# EAGLE design CC2-32K-EPROM-CARTRIDGE-2012-V1RA (EAGLE 5.10)
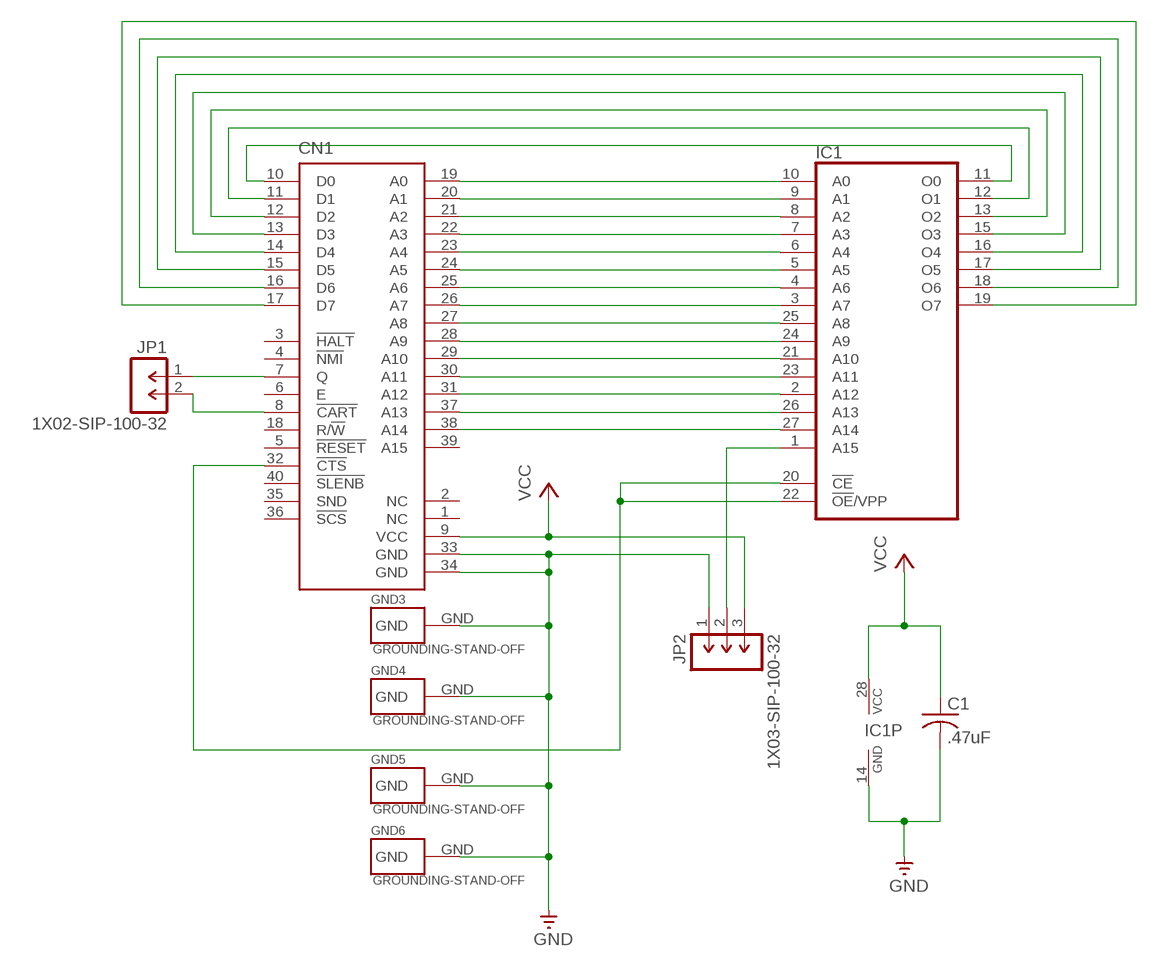
[diagram p0: schematic, sheet 1]

## Parts
C1  .47uF  NP-CAPACITOR-C050-025X075  [C050-025X075]
CN1  COCO3-CARTRIDGE-PLUG-SHORT  [EDGE-CARD-PLUG-2X20-100-SHORT]
GND3  GROUNDING-STAND-OFF  [STAND-OFF]
GND4  GROUNDING-STAND-OFF  [STAND-OFF]
GND5  GROUNDING-STAND-OFF  [STAND-OFF]
GND6  GROUNDING-STAND-OFF  [STAND-OFF]
IC1  27C512D-MINIMAL-OUTLINE  [DIL28-6-MINIMAL-OUTLINE]
JP1  1X02-SIP-100-32  [SIL1X02-100]
JP2  1X03-SIP-100-32  [SIL1X03-100]

## Nets
GND [power]: C1.2(-) CN1.33(GND) CN1.34(GND) GND3.GND GND4.GND GND5.GND GND6.GND IC1.14(GND) JP2.1
N$1: CN1.7(Q) JP1.1
N$2: CN1.8(!CART) JP1.2
N$4: CN1.32(!CTS) IC1.20(!CE) IC1.22(!OE!/VPP)
N$5: IC1.1(A15) JP2.2
N$6: CN1.10(D0) IC1.11(O0)
N$7: CN1.11(D1) IC1.12(O1)
N$8: CN1.19(A0) IC1.10(A0)
N$9: CN1.38(A14) IC1.27(A14)
N$10: CN1.37(A13) IC1.26(A13)
N$11: CN1.31(A12) IC1.2(A12)
N$12: CN1.30(A11) IC1.23(A11)
N$13: CN1.29(A10) IC1.21(A10)
N$14: CN1.28(A9) IC1.24(A9)
N$15: CN1.27(A8) IC1.25(A8)
N$16: CN1.26(A7) IC1.3(A7)
N$17: CN1.25(A6) IC1.4(A6)
N$18: CN1.24(A5) IC1.5(A5)
N$19: CN1.23(A4) IC1.6(A4)
N$20: CN1.22(A3) IC1.7(A3)
N$21: CN1.21(A2) IC1.8(A2)
N$22: CN1.20(A1) IC1.9(A1)
N$23: CN1.12(D2) IC1.13(O2)
N$24: CN1.13(D3) IC1.15(O3)
N$25: CN1.14(D4) IC1.16(O4)
N$26: CN1.15(D5) IC1.17(O5)
N$27: CN1.16(D6) IC1.18(O6)
N$28: CN1.17(D7) IC1.19(O7)
VCC [power]: C1.1(+) CN1.9(VCC) IC1.28(VCC) JP2.3
Unconnected: CN1.1(NC) CN1.2(NC) CN1.3(!HALT) CN1.4(!NMI) CN1.5(!RESET) CN1.6(E) CN1.18(R/!W) CN1.35(SND) CN1.36(!SCS) CN1.39(A15) CN1.40(!SLENB)

## Library data of the parts
C1 = GIMEchip-Capacitor:NP-CAPACITOR: NON-POLARIZED CAPACITOR grid 5mm
CN1 = GIMEchip-TRS-80-CoCo-3-Program-Pak-Cartridge:COCO3-CARTRIDGE-PLUG: CoCo 3 Program Pak Cartridge Plug - http://www.GIMEchip.com/ Tandy Radio Shack TRS-80 Color Computer 3 Program Pak Cartridge Plug (Edge-Card) E.A.G.L.E. Library Part created by John Eric Turner & His Father - sales@gimechip.com <mailto:sales@gimechip.com?subject=Tandy Radio Shack TRS- 80 Color Computer 3 Program Pak Cartridge Plug (Edge-Card) E.A.G.L.E. Library Part> 40-Pin Edge-Card sharing the same pinout as the Program Pak Cartridge Edge-Card Connector. This library part has been designed to provide a 40-pin cartridge plug connector matching the CoCo's Edge-Card connector (Cartridge Slot). This library part is also useful with the Dragon and other CoCo clones. It is important to note that the CoCo 2 & 3 only provide +5V at the cartridge connector. The CoCo 1 provides +5V AND +/-12V at the cartridge connector. The Dragon provides only +5V and +12V at the cartridge connector. The table below lists all similarities and differences between these machines, relevant to the cartridge slot: PIN # TRS-80 "CoCo 1" Function Tano/Dragon Data "Dragon 32/64" Function TRS-80 "CoCo 2 & 3" Function 1 -12V +12V NC 2 +12V +12V NC 3 HALT* HALT* HALT* 4 NMI* NMI* NMI* 5 RESET* RESET* RESET* 6 E E E 7 Q Q Q 8 CART* CART* CART* 9 +5V +5V +5V 10 D0 D0 D0 11 D1 D1 D1 12 D2 D2 D2 13 D3 D3 D3 14 D4 D4 D4 15 D5 D5 D5 16 D6 D6 D6 17 D7 D7 D7 18 R/W* R/W* R/W* 19 A0 A0 A0 20 A1 A1 A1 21 A2 A2 A2 22 A3 A3 A3 23 A4 A4 A4 24 A5 A5 A5 25 A6 A6 A6 26 A7 A7 A7 27 A8 A8 A8 28 A9 A9 A9 29 A10 A10 A10 30 A11 A11 A11 31 A12 A12 A12 32 CTS* CSEL* CTS* 33 GND GND GND 34 GND GND GND 35 SND SND SND 36 SCS* P2* SCS* 37 A13 A13 A13 38 A14 A14 A14 39 A15 A15 A15 40 SLENB* DSD* SLENB*
GND3-GND6 = GIMEchip-Grounding:GROUNDING
IC1 = GIMEchip-EPROM:27C512D: MEMORY
JP1 = GIMEchip-Header-Generic:1X02: MALE HEADER
JP2 = GIMEchip-Header-Generic:1X03: MALE HEADER

## Net classes
0 default: width 0.203 mm, clearance 0.203 mm
1 power: width 0.762 mm, clearance 0.203 mm

## Board
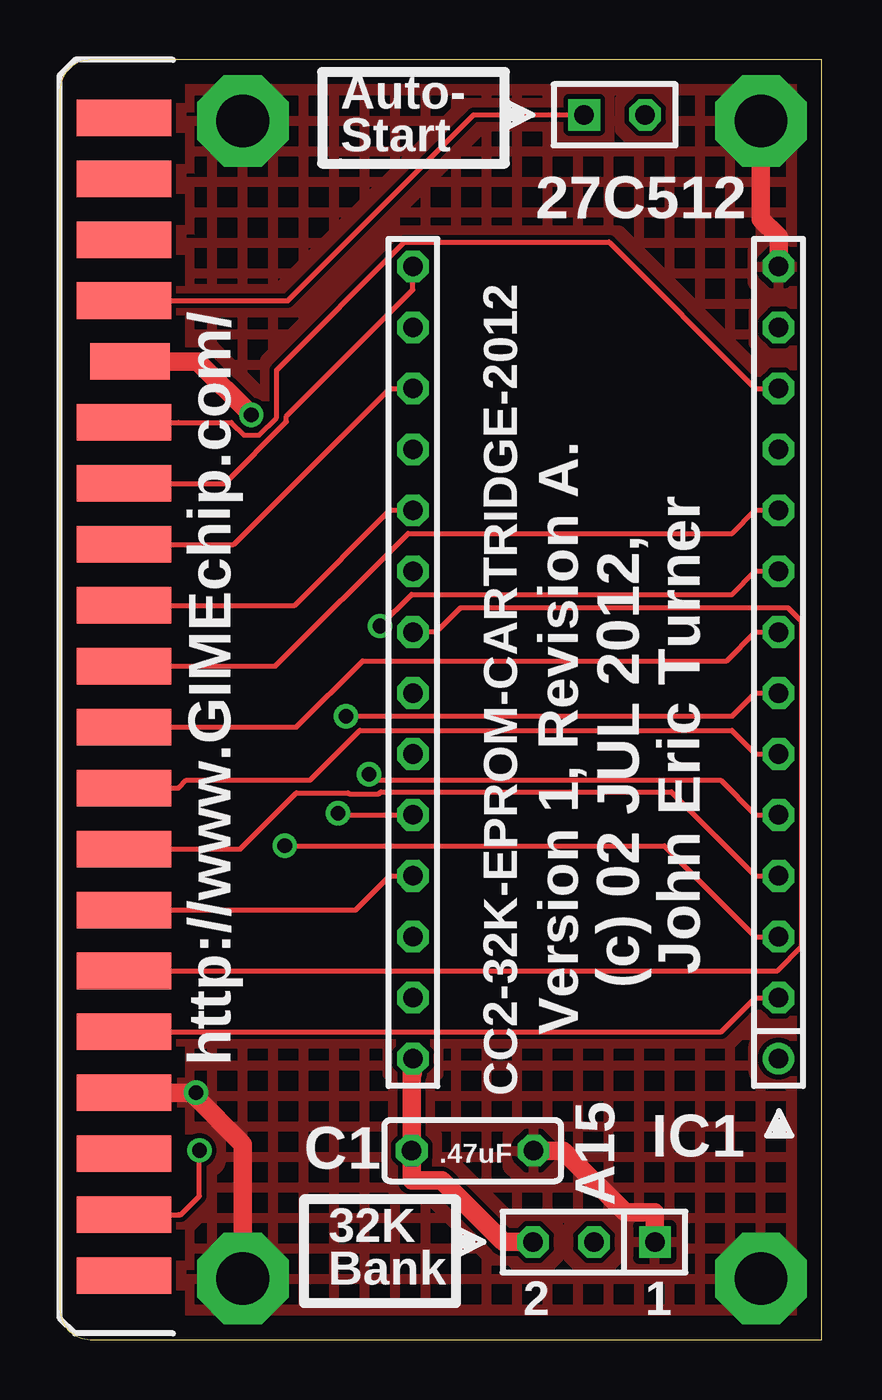
[diagram p1: board, top side]
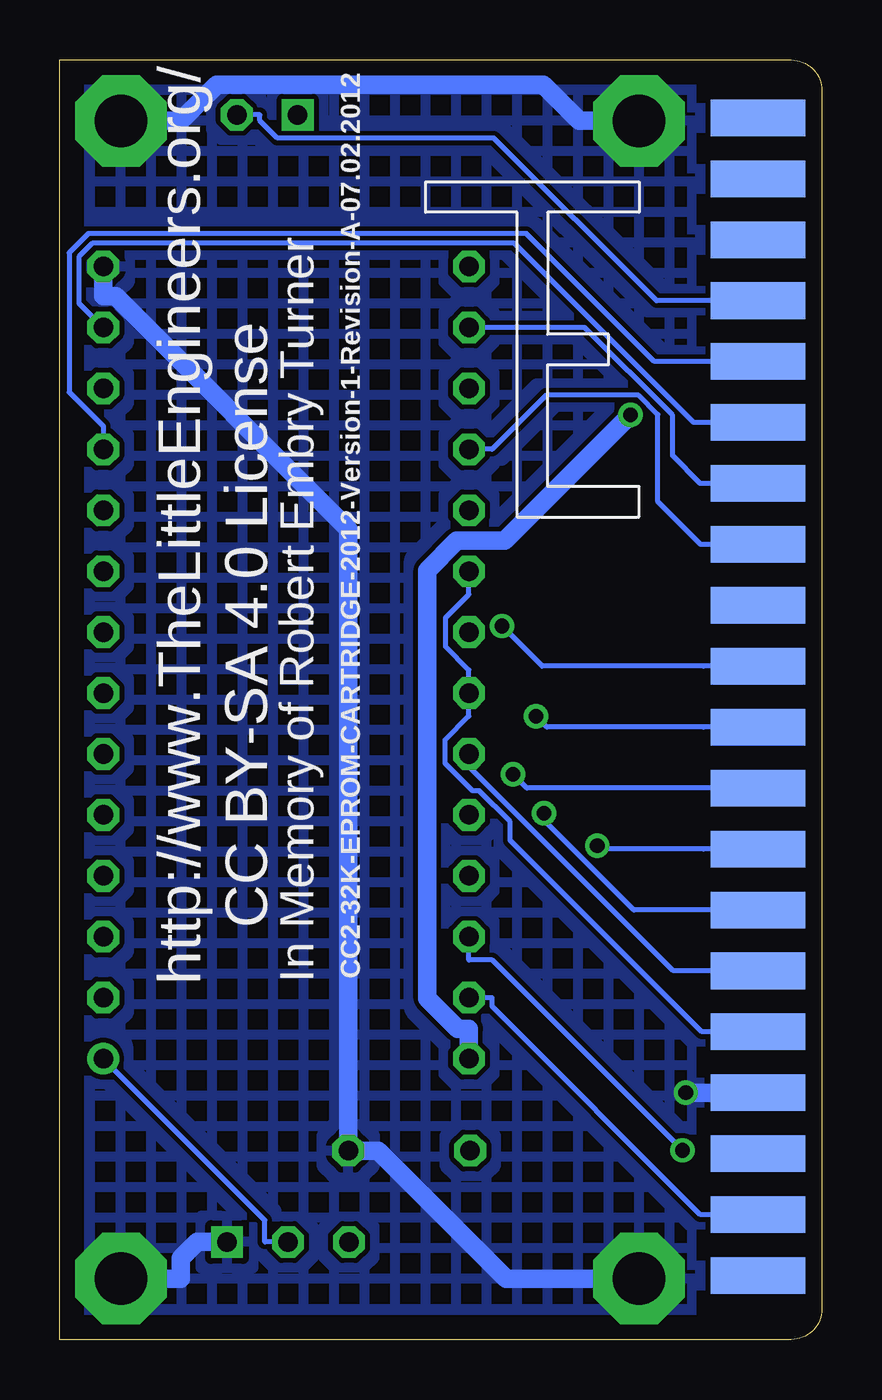
[diagram p2: board, bottom side, seen from below]

Size 31.75 x 53.34 mm. Coordinates in mm from the lower left corner, seen from the top.
Outline: 31.75,0 31.75,53.34 1.27,53.34 arc90 0,52.07 0,1.27 arc90 1.27,0 31.75,0
Copper layers (1*16): Top 0.035mm / dielectric 1.5mm / Bottom 0.035mm
Design rules "default": minimum track width 10mil, minimum drill 24mil, track to track 8mil, track to pad 8mil, pad to pad 8mil, via to via 8mil, smd to smd 8mil, copper to edge 40mil, drill to drill 8mil, minimum pad ring 10mil, minimum via ring 8mil, stop-mask expansion 4mil, vias tented up to drill 0mil, thermal gap 10mil
vRestrict: area 15.2,10.2 to 29.2,49.5

### Footprints (pad centres in the part's own frame; a part is rotated, then mirrored left to right if it is on the bottom)
C050-025X075 = drill 0.813 octagon: 1 -2.54,0; 2 2.54,0
EDGE-CARD-PLUG-2X20-100-SHORT = smd 3.937 x 1.524: 1 3.81,24.13; 3 3.81,21.59; 5 3.81,19.05; 7 3.81,16.51; 11 3.81,11.43; 13 3.81,8.89; 15 3.81,6.35; 17 3.81,3.81; 19 3.81,1.27; 21 3.81,-1.27; 23 3.81,-3.81; 25 3.81,-6.35; 27 3.81,-8.89; 29 3.81,-11.43; 31 3.81,-13.97; 33 3.81,-16.51; 35 3.81,-19.05; 37 3.81,-21.59; 39 3.81,-24.13 | smd 3.937 x 1.524 bottom: 2 3.81,24.13; 4 3.81,21.59; 6 3.81,19.05; 8 3.81,16.51; 10 3.81,13.97; 12 3.81,11.43; 14 3.81,8.89; 16 3.81,6.35; 18 3.81,3.81; 20 3.81,1.27; 22 3.81,-1.27; 24 3.81,-3.81; 26 3.81,-6.35; 28 3.81,-8.89; 30 3.81,-11.43; 32 3.81,-13.97; 34 3.81,-16.51; 36 3.81,-19.05; 38 3.81,-21.59; 40 3.81,-24.13 | smd 3.302 x 1.524: 9 4.064,13.97
STAND-OFF = drill 2.2 pad 3.81 octagon: GND 0,0
DIL28-6-MINIMAL-OUTLINE = drill 0.813 round: 1 -16.51,-7.62 | drill 0.813 octagon: 2 -13.97,-7.62; 3 -11.43,-7.62; 4 -8.89,-7.62; 5 -6.35,-7.62; 6 -3.81,-7.62; 7 -1.27,-7.62; 8 1.27,-7.62; 9 3.81,-7.62; 10 6.35,-7.62; 11 8.89,-7.62; 12 11.43,-7.62; 13 13.97,-7.62; 14 16.51,-7.62; 15 16.51,7.62; 16 13.97,7.62; 17 11.43,7.62; 18 8.89,7.62; 19 6.35,7.62; 20 3.81,7.62; 21 1.27,7.62; 22 -1.27,7.62; 23 -3.81,7.62; 24 -6.35,7.62; 25 -8.89,7.62; 26 -11.43,7.62; 27 -13.97,7.62; 28 -16.51,7.62
SIL1X02-100 = drill 0.813 square: 1 -1.27,0 | drill 0.813 octagon: 2 1.27,0
SIL1X03-100 = drill 0.813 square: 1 -2.54,0 | drill 0.813 octagon: 2 0,0; 3 2.54,0

### Placement (x,y rotation side)
C1  17.2,7.87 0 top
CN1  -1.14,26.8 0 top
GND3  29.21,50.8 0 top
GND4  29.21,2.54 0 top
GND5  7.62,50.8 0 top
GND6  7.62,2.54 0 top
IC1  22.33,28.22 90 top
JP1  23.11,51.05 0 top
JP2  22.25,4.06 180 top
U$1  [TLE-LOGO-5]  16.51,34.29 0 bottom

### Tracks (layer width: path | path; a pad name or v marks a point on that pad's centre or on a via)
GND  (via drill 0.61 pad 1.02)
  Top 0.762: 5.58,10.19 5.48,10.29 CN1.34 | GND6.GND 7.62,8.14 5.58,10.19 | 5.58,10.19 v5.67,10.29 | IC1.14 29.95,45.97 29.21,46.71 GND3.GND | JP2.1 24.79,5.31 23.55,5.31 20.98,7.87 C1.2
  Bottom 0.762: v5.67,10.29 CN1.34 | GND5.GND 10.11,50.8 11.61,52.3 25.22,52.3 26.72,50.8 GND3.GND | GND6.GND 13.16,2.54 18.49,7.87 C1.2 19.74,9.12 19.74,33.79 29.43,43.48 29.95,43.48 IC1.14 | JP2.1 26.04,4.06 26.72,3.38 26.72,2.54 GND4.GND
  pour Top (hatched): -0.25,53.59 32,53.59 32,-0.25 -0.25,-0.25
  pour Bottom (hatched): -0.25,53.59 32,53.59 32,-0.25 -0.25,-0.25
N$1
  Top 0.203: JP1.1 17.24,51.05 9.49,43.31 CN1.7
N$2
  Bottom 0.203: JP1.2 23.42,51.05 23.42,50.81 22.7,50.09 13.67,50.09 6.89,43.31 CN1.8
N$4
  Bottom 0.203: IC1.20 14.71,31.06 15.68,30.09 15.68,28.89 14.71,27.92 IC1.22 14.71,26.69 14.71,25.98 15.7,24.99 15.7,24.01 14.55,22.87 14.27,22.87 12.99,21.59 12.99,20.81 5,12.83 CN1.32
N$5
  Bottom 0.203: JP2.2 23.22,4.06 23.22,4.98 IC1.1
N$6
  Bottom 0.203: CN1.10 6.98,40.77 12.32,46.1 30.57,46.1 31.36,45.3 31.36,39.49 29.95,38.08 IC1.11
N$7
  Top 0.203: CN1.11 4.94,38.23 7.14,38.23 7.67,37.7 8.29,37.7 9.03,38.44 9.03,40.42 14.36,45.74 22.89,45.74 28.98,39.65 IC1.12
N$8
  Top 0.203: IC1.10 28.98,34.57 28.02,33.6 14.51,33.6 8.97,28.07 CN1.19
N$9
  Bottom 0.203: IC1.27 13.74,14.25 13.74,13.89 5.06,5.21 CN1.38
N$10  (via drill 0.61 pad 1.02)
  Top 0.203: v5.81,7.89 5.81,5.97 5.04,5.21 4.94,5.21 CN1.37
  Bottom 0.203: IC1.26 14.71,15.82 13.74,15.82 v5.81,7.89
N$11
  Top 0.203: IC1.2 28.98,14.25 27.56,12.83 CN1.31
N$12
  Bottom 0.203: IC1.23 14.71,23.88 6.19,15.37 CN1.30
N$13
  Top 0.203: IC1.21 15.67,29.49 16.68,30.5 30.34,30.5 30.92,29.92 30.92,16.38 29.9,15.37 CN1.29
N$14  (via drill 0.61 pad 1.02)
  Top 0.203: v11.59,21.94 11.66,21.87 13.74,21.87 IC1.24
  Bottom 0.203: v11.59,21.94 11.59,21.66 7.84,17.91 CN1.28
N$15
  Top 0.203: CN1.27 12.32,17.91 13.74,19.33 IC1.25
N$16  (via drill 0.61 pad 1.02)
  Top 0.203: v9.36,20.58 25.19,20.58 28.98,16.79 IC1.3
  Bottom 0.203: v9.36,20.58 9.23,20.45 4.94,20.45 CN1.26
N$17
  Top 0.203: CN1.25 4.94,20.45 7.51,20.45 9.85,22.79 12.01,22.79 12.05,22.75 13.29,22.75 13.37,22.83 25.48,22.83 28.98,19.33 IC1.4
N$18  (via drill 0.61 pad 1.02)
  Top 0.203: v12.87,23.56 13.12,23.32 27.53,23.32 28.98,21.87 IC1.5
  Bottom 0.203: CN1.24 12.3,22.99 v12.87,23.56
N$19
  Top 0.203: CN1.23 4.94,22.99 5.27,23.32 10.42,23.32 12.5,25.39 28,25.39 28.98,24.41 IC1.6
N$20  (via drill 0.61 pad 1.02)
  Top 0.203: v11.92,25.98 28.02,25.98 28.98,26.95 IC1.7
  Bottom 0.203: v11.92,25.98 11.46,25.53 4.94,25.53 CN1.22
N$21
  Top 0.203: CN1.21 4.94,25.53 9.86,25.53 12.61,28.29 27.78,28.29 28.98,29.49 IC1.8
N$22  (via drill 0.61 pad 1.02)
  Top 0.203: v13.33,29.74 14.65,31.06 28.02,31.06 28.98,32.03 IC1.9
  Bottom 0.203: v13.33,29.74 11.65,28.07 4.94,28.07 CN1.20
N$23
  Bottom 0.203: IC1.13 30.96,43.2 30.96,45.13 30.4,45.69 12.82,45.69 5.35,38.23 CN1.12
N$24
  Top 0.203: CN1.13 6.86,35.69 9.44,38.26 9.44,38.49 14.71,43.76 IC1.15
N$25
  Bottom 0.203: CN1.14 5.07,35.69 6.22,36.84 6.22,38.53 9.89,42.19 13.74,42.19 IC1.16
N$26
  Top 0.203: IC1.17 13.74,39.65 7.24,33.15 CN1.15
N$27
  Bottom 0.203: CN1.16 5.05,33.15 6.83,34.93 6.83,38.56 7.63,39.36 11.49,39.36 13.74,37.11 IC1.18
N$28
  Top 0.203: IC1.19 13.74,34.57 9.78,30.61 CN1.17
VCC  (via drill 0.61 pad 1.02)
  Top 0.762: v7.97,38.55 5.75,40.77 CN1.9 | IC1.28 14.71,11.09 14.66,11.09 14.66,9.12 C1.1 14.66,6.63 15.9,6.63 18.47,4.06 JP2.3
  Bottom 0.762: IC1.28 14.71,12.95 15.17,12.95 16.44,14.22 16.44,32.06 15.21,33.3 13.22,33.3 v7.97,38.55

### Text on the board
bPlace: http://www.TheLittleEngineers.org/ | CC2-32K-EPROM-CARTRIDGE-2012-Version-1-Revision-A-07.02.2012 | In Memory of Robert Embry Turner | CC BY-SA 4.0 License
tNames: Auto- | Start | 27C512 | IC1 | JP2 | C1 | JP1 | GND3 | GND4 | GND5 | GND6 | CN1 | John Eric Turner | (c) 02 JUL 2012, | Version 1, Revision A. | http://www.GIMEchip.com/ | CC2-32K-EPROM-CARTRIDGE-2012 | C1 | IC1 | A15 | 32K | Bank | 2 | 1